# EasyEDA Pro project 2026-01-18_TinZr_Rev5_EasyEDA_project.eprj

# Schematic TinZr_Rev5_Schematic
Board Name: Chip; Create Date: 2025-05-02; Page Name: P1; Project Name: ESP32-C3_Rev5; Schematic Name: TinZr_Rev5_Schematic; Update Date: 2026-01-17; Company: NJIT/WCM; Drawn: Ludvik Alkhoury; Page Size: A4; Reviewed: Tony Moore; Version: Rev5
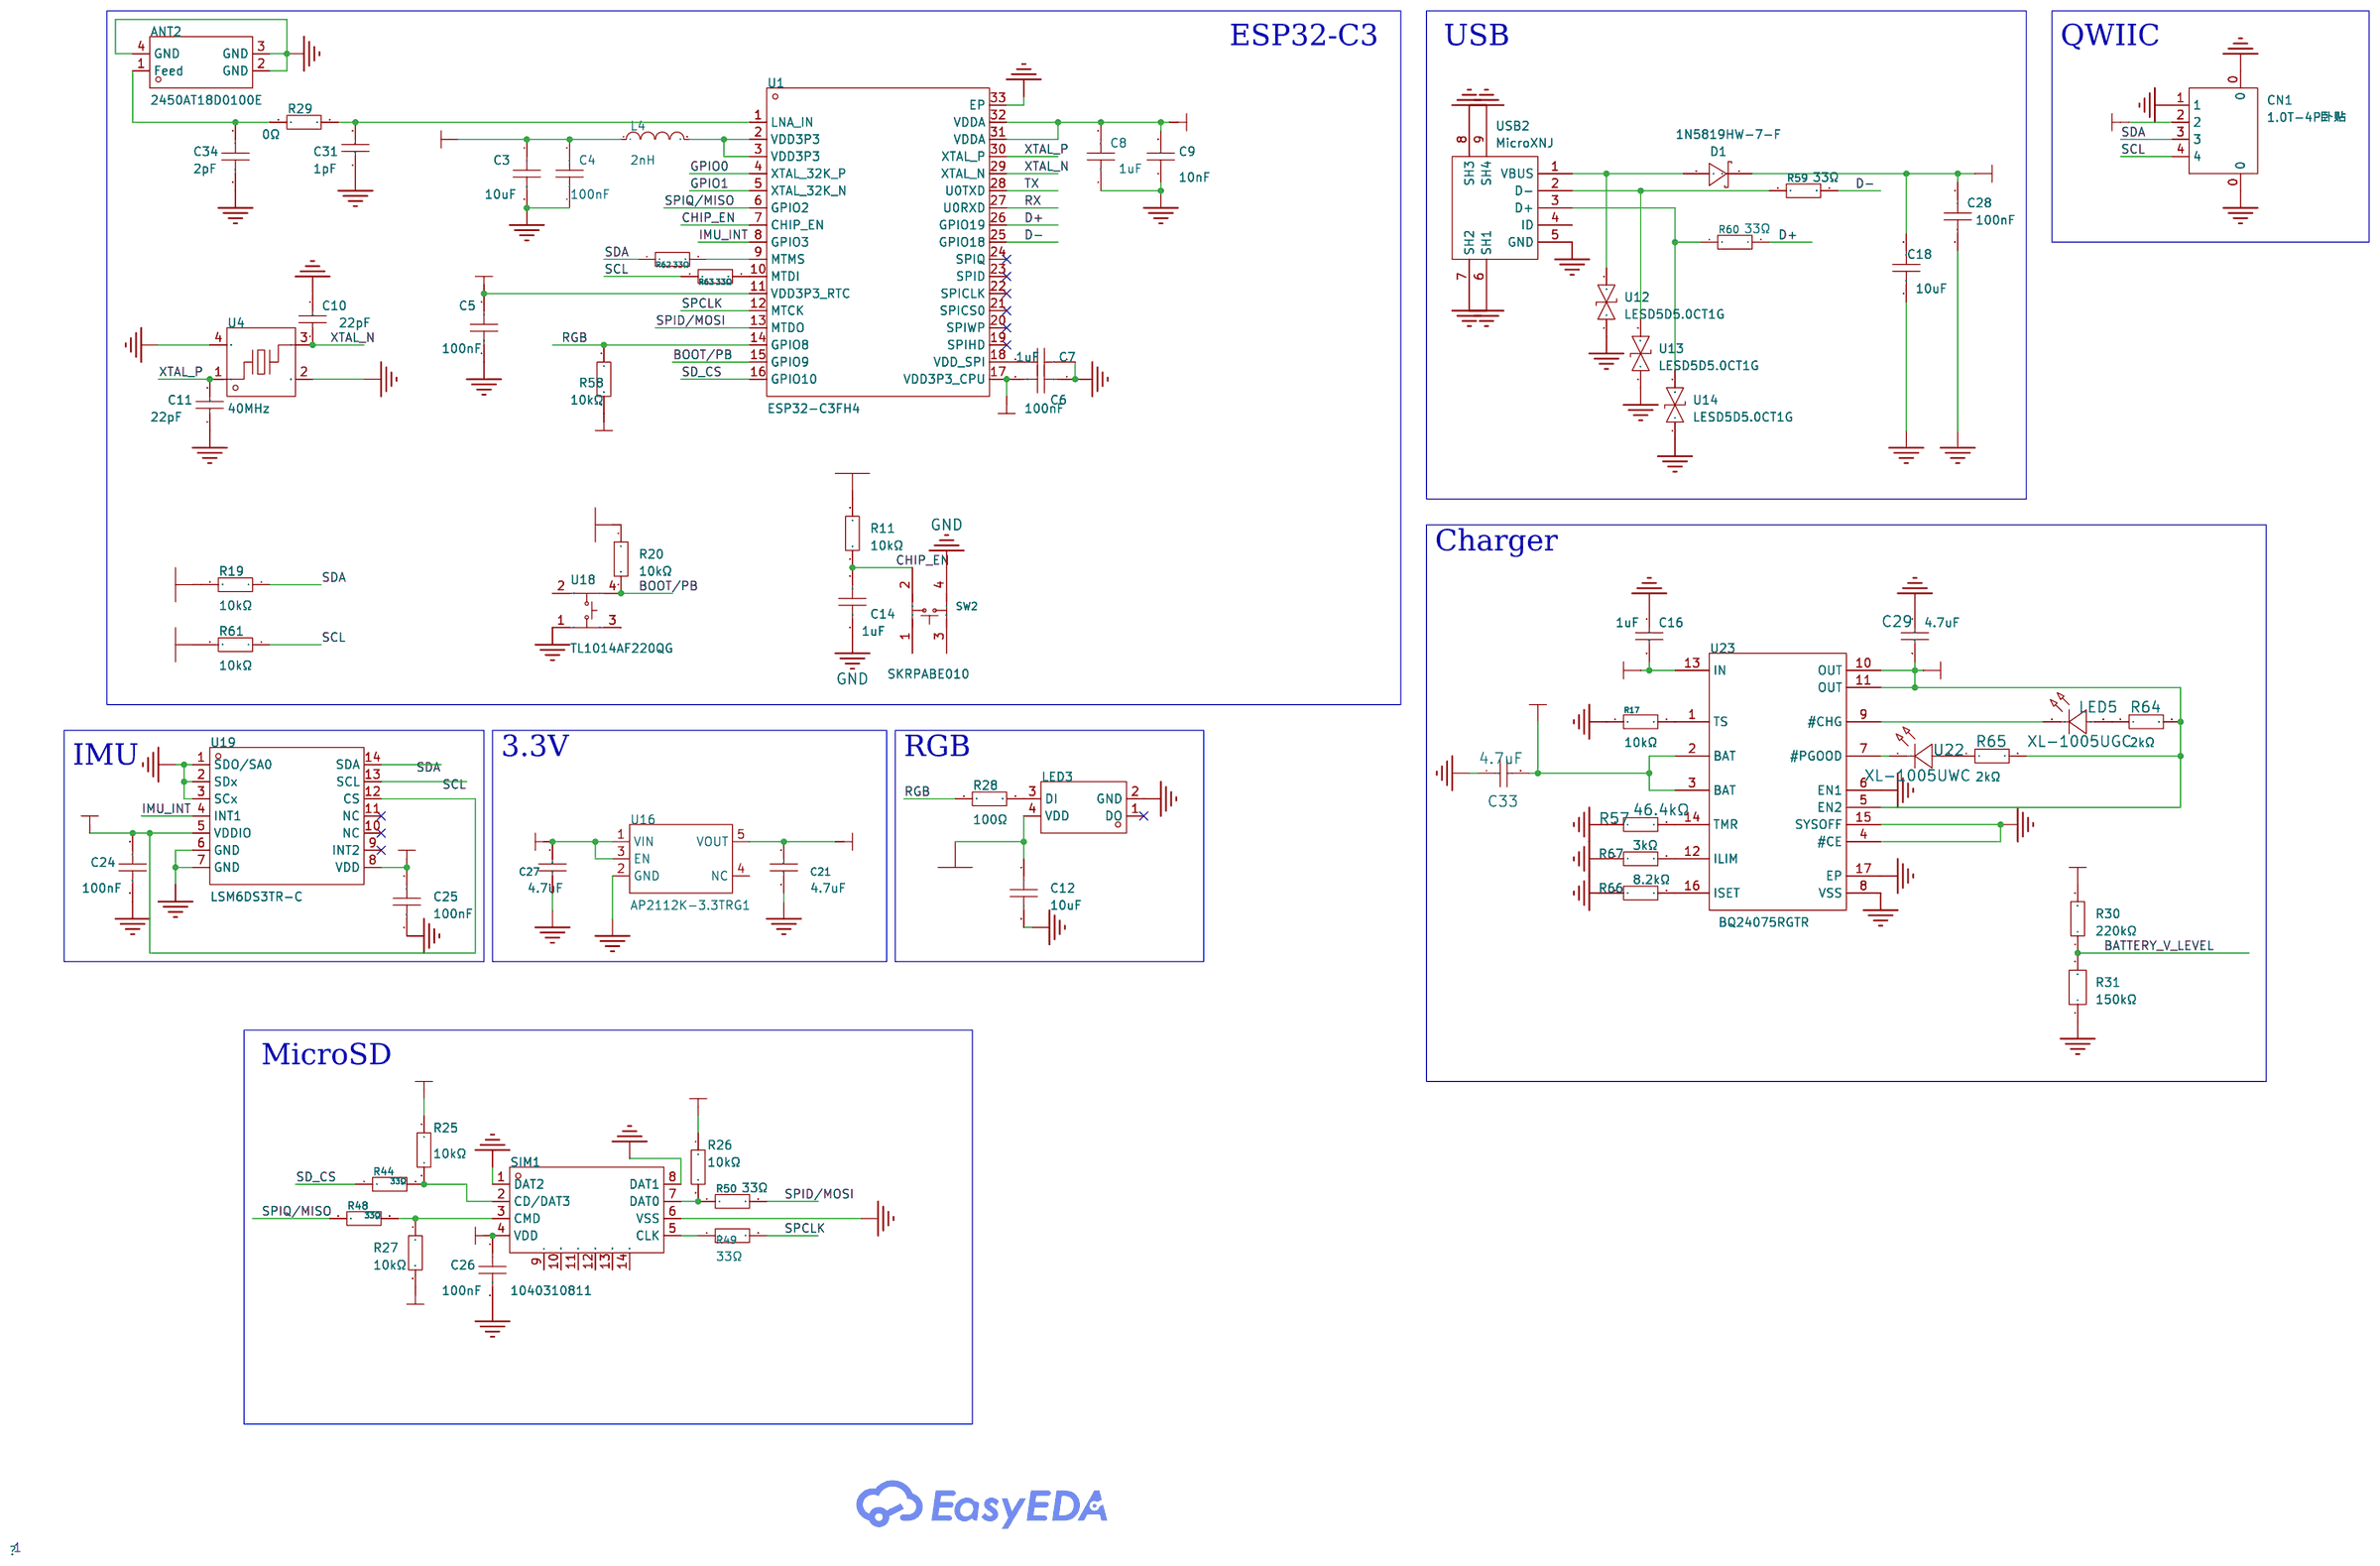
[diagram p0: schematic sheet]

## Parts
ANT2  2450AT18D0100E  [ANT-SMD_4P-L3.2-W1.6]
C3  10uF  [c0402]
C4  100nF  [c0402]
C5  100nF  [c0402]
C6  100nF  [c0402]
C7  1uF  [c0402]
C8  1uF  [c0402]
C9  10nF  [c0402]
C10  22pF  [c0402]
C11  22pF  [c0402]
C12  10uF  [c0402]
C14  1uF  [c0402]
C16  1uF  [C0402]
C18  10uF  [C0805]
C21  4.7uF  [C0603]
C24  100nF  [c0402]
C25  100nF  [c0402]
C26  100nF  [c0402]
C27  4.7uF  [C0603]
C28  100nF  [c0402]
C29  4.7uF  [C0603]
C31  1pF  [C0402]  (no BOM)
C33  4.7uF  [C0603]
C34  2pF  [C0402]
CN1  1.0T-4P卧贴  [CONN-SMD_1.0T-4P]
D1  1N5819HW-7-F  [SOD-123_L2.7-W1.6-LS3.7-RD]
L4  2nH  [L0603]
LED3  WS2812C-2020-V1  [LED-SMD_4P-L2.0-W2.0-TL_WS2812B-2020]
LED5  XL-1005UGC  [LED0402-RD_GREEN]
R11  10kΩ  [r0402]
R17  10kΩ  [R0603]
R19  10kΩ  [r0402]
R20  10kΩ  [r0402]
R25  10kΩ  [r0402]
R26  10kΩ  [r0402]
R27  10kΩ  [r0402]
R28  100Ω  [R0402]
R29  0Ω  [R0402]
R30  220kΩ  [R0402]
R31  150kΩ  [R0402]
R44  33Ω  [R0402]
R48  33Ω  [R0402]
R49  33Ω  [R0402]
R50  33Ω  [R0402]
R57  46.4kΩ  [R0402]
R58  10kΩ  [r0402]
R59  33Ω  [R0402]
R60  33Ω  [R0402]
R61  10kΩ  [r0402]
R62  33Ω  [R0402]
R63  33Ω  [R0402]
R64  2kΩ  [R0402]
R65  2kΩ  [R0402]
R66  8.2kΩ  [R0402]
R67  3kΩ  [R0402]
SIM1  1040310811  [SIM-SMD_8P-1040310811]
SW2  SKRPABE010  [KEY-SMD_4P-L4.2-W3.2-P2.20-LS4.6]
U1  ESP32-C3FH4  [QFN-32_L5.0-W5.0-P0.50-TL-EP3.7]
U4  40MHz  [CRYSTAL-SMD_4P-L2.0-W1.6-BL_7D026000M01]
U12  LESD5D5.0CT1G  [SOD-523_L1.2-W0.8-LS1.6-BI]
U13  LESD5D5.0CT1G  [SOD-523_L1.2-W0.8-LS1.6-BI]
U14  LESD5D5.0CT1G  [SOD-523_L1.2-W0.8-LS1.6-BI]
U16  AP2112K-3.3TRG1  [SOT-23-5_L2.9-W1.6-P0.95-LS2.8-BR]
U18  TL1014AF220QG  [SW-SMD_E-SWITCH_TL1014AFXXX]
U19  LSM6DS3TR-C  [LGA-14_L3.0-W2.5-P0.50-TL]
U22  XL-1005UWC  [LED0402-RD_YELLOW]
U23  BQ24075RGTR  [QFN-16_L3.0-W3.0-P0.50-TL-EP1.7]
USB2  MicroXNJ  [MICRO-USB-SMD_MICROXNJ_1]

## Library data of the parts
ANT2 = 2450AT18D0100E: LCSC Part Name: 2.4-2.5GHz; Supplier Part: C2917718; Manufacturer: JOHANSON(约翰逊); Supplier Footprint: 1206; JLCPCB Part Class: Extended Part; Datasheet: https://atta.szlcsc.com/upload/public/pdf/source/20240402/27B7F25B31BFFE47FFBDA84F15358426.pdf; Supplier: LCSC; Antenna Type: Chip Antenna; Central Frequency: 2.4GHz; Peak Gain: 1.5dBi; Power capacity: 2W
C3 C12 = CL10A106KP8NNNC: 容值:10uF;精度:±10%;额定电压:10V;材质(温度系数):X5R;; LCSC Part Name: 10uF ±10% 10V; Supplier Part: C315248; Manufacturer: SAMSUNG(三星); Manufacturer Part: CL05A106MP5NUNC; Supplier Footprint: 0603; JLCPCB Part Class: 基础库; Datasheet: https://atta.szlcsc.com/upload/public/pdf/source/20160218/1457707763339.pdf; Supplier: LCSC; Tolerance: ±10%; Voltage Rated: 10V; Temperature Coefficient: X5R
C4-C6 C24-C26 C28 = CL05B104KO5NNNC: 容值:100nF;精度:±10%;额定电压:16V;材质(温度系数):X7R;; LCSC Part Name: 100nF ±10% 16V; Supplier Part: C1525; Manufacturer: SAMSUNG(三星); Supplier Footprint: 0402; JLCPCB Part Class: 基础库; Datasheet: https://atta.szlcsc.com/upload/public/pdf/source/20160218/1457707763339.pdf; Supplier: LCSC; Tolerance: ±10%; Voltage Rated: 16V; Temperature Coefficient: X7R
C7 C8 C14 = CL05A105KA5NQNC: 容值:1uF;精度:±10%;额定电压:25V;材质(温度系数):X5R;; LCSC Part Name: 1uF ±10% 25V; Supplier Part: C52923; Manufacturer: SAMSUNG(三星); Supplier Footprint: 0402; JLCPCB Part Class: 基础库; Datasheet: https://atta.szlcsc.com/upload/public/pdf/source/20160218/1457707763339.pdf; Supplier: LCSC; Tolerance: ±10%; Voltage Rated: 25V; Temperature Coefficient: X5R
C9 = CL05B103KB5NNNC: 容值:10nF;精度:±10%;额定电压:50V;材质(温度系数):X7R;; LCSC Part Name: 10nF ±10% 50V; Supplier Part: C15195; Manufacturer: SAMSUNG(三星); Supplier Footprint: 0402; JLCPCB Part Class: 基础库; Datasheet: https://atta.szlcsc.com/upload/public/pdf/source/20160218/1457707763339.pdf; Supplier: LCSC; Tolerance: ±10%; Voltage Rated: 50V; Temperature Coefficient: X7R
C10 C11 = 0402CG220J500NT: 容值:22pF;精度:±5%;额定电压:50V;材质(温度系数):C0G;; LCSC Part Name: 22pF ±5% 50V; Supplier Part: C1555; Manufacturer: FH(风华); Supplier Footprint: 0402; JLCPCB Part Class: 基础库; Datasheet: https://atta.szlcsc.com/upload/public/pdf/source/20200305/C486355_26A10D38EF8C2A5C37091D0039909270.pdf; Supplier: LCSC; Tolerance: ±5%; Voltage Rated: 50V; Temperature Coefficient: C0G
C16 = LMK105BJ105KV-F: LCSC Part Name: 1uF ±10% 10V; Supplier Part: C87145; Manufacturer: TAIYO YUDEN(太诱); Supplier Footprint: 0402; JLCPCB Part Class: Extended Part; Datasheet: https://atta.szlcsc.com/upload/public/pdf/source/20190909/C426322_488BD416A500F475FF85774A153C014C.pdf; Supplier: LCSC; Tolerance: ±10%
C18 = CL21A106KAYNNNE_C15850: LCSC Part Name: 10uF ±10% 25V; Supplier Part: C15850; Manufacturer: SAMSUNG(三星); Manufacturer Part: CL21A106KAYNNNE; Supplier Footprint: 0805; JLCPCB Part Class: Basic Part; Datasheet: https://atta.szlcsc.com/upload/public/pdf/source/20160218/1457707763339.pdf; Supplier: LCSC; Tolerance: ±10%
C21 C27 C29 C33 = CL10A475KP8NNNC: LCSC Part Name: 4.7uF ±10% 10V; Supplier Part: C1705; Manufacturer: SAMSUNG(三星); Manufacturer Part: CL10A475KO8NNNC; Supplier Footprint: 0603; JLCPCB Part Class: Extended Part; Datasheet: https://atta.szlcsc.com/upload/public/pdf/source/20160218/1457707763339.pdf; Supplier: LCSC; Tolerance: ±10%
C31 = GRM1555C1H1R0CA01D: LCSC Part Name: 1pF 50V; Supplier Part: C76953; Manufacturer: muRata(村田); Supplier Footprint: 0402; JLCPCB Part Class: Extended Part; Datasheet: https://atta.szlcsc.com/upload/public/pdf/source/20180307/C76953_15204091218821407741.pdf; Supplier: LCSC
C34 = CGA2B2NP01H020C050BA: LCSC Part Name: ±0.25pF 2pF 50V; Supplier Part: C2181699; Manufacturer: TDK; Supplier Footprint: 0402; JLCPCB Part Class: Extended Part; Datasheet: https://item.szlcsc.com/datasheet/CGA2B2NP01H020C050BA/2273766.html; Supplier: LCSC; Voltage Rating: 50V; Temperature Coefficient: NP0
CN1 = 1.0T-4P卧贴: LCSC Part Name: 1x4P 间距:1mm 卧贴 系列:SH; Supplier Part: C145956; Manufacturer: BOOMELE(博穆精密); Supplier Footprint: SMD,P=1mm; JLCPCB Part Class: Extended Part; Datasheet: https://atta.szlcsc.com/upload/public/pdf/source/20171115/C145958_15107293423141120443.pdf; Supplier: LCSC; Pins Structure: 1x4P; Pitch: 1mm; Mounting Type: Horizontal attachment; Reference Series: SH; Number of Pins: 4P; Number of Rows: 1; Number of PINs Per Row: 4
D1 = 1N5819HW-7-F: LCSC Part Name: 电压:40V 电流:1A; Supplier Part: C82544; Manufacturer: DIODES(美台); Supplier Footprint: SOD-123; JLCPCB Part Class: Extended Part; Datasheet: https://atta.szlcsc.com/upload/public/pdf/source/20161024/1477288459223.pdf; Supplier: LCSC; Forward Voltage (Vf@If): 450mV@1A; Reverse Voltage (Vr): 40V; Rectified Current: 1A; Reverse Leakage Current (Ir): 1mA@40V
L4 = SDCL1608C2N0STDF_C370234: Supplier Part: C370234; Manufacturer: Sunlord(顺络); Manufacturer Part: SDCL1608C2N0STDF; Supplier Footprint: 0603; JLCPCB Part Class: Extended Part; Datasheet: https://item.szlcsc.com/datasheet/SDCL1608C2N0STDF/343985.html; Supplier: LCSC
LED3 = WS2812C-2020-V1: 小电流，小尺寸，适用于小尺寸，小间距产品，散热好，汽车氛围灯; LCSC Part Name: RGB三色; Supplier Part: C2976072; Manufacturer: worldsemi; Supplier Footprint: SMD,2x2mm; JLCPCB Part Class: 扩展库; Datasheet: https://atta.szlcsc.com/upload/public/pdf/source/20220222/52A01000447F5320C9A8C3F34CEFDB81.pdf; Supplier: LCSC
LED5 = XL-1005UGC_C965793: Supplier Part: C965793; Manufacturer: XINGLIGHT(成兴光); Supplier Footprint: 0402; JLCPCB Part Class: Extended Part; Datasheet: https://atta.szlcsc.com/upload/public/pdf/source/20201230/C965793_0CDDD21E721E0FD2A4CEAFDFDBC3C135.pdf; Supplier: LCSC; Emitted Color: Emerald; Forward Voltage (VF): 3V; Power Dissipation: 80mW; Forward Current: 25mA; Dominant Wavelength: 516nm~531nm; Peak Wavelength: 531nm; Lens Color: Colorless Transparent Lens; Luminous Intensity: 249mcd; Viewing Angle: 120°; Mounting Sytle: Positive Stick; Operating Temperature: -30℃~+85℃
R11 R19 R20 R25-R27 R58 R61 = 0603WAF1002T5E: 电阻类型:厚膜电阻;阻值:10kΩ;精度:±1%;功率:1/10W;温度系数:±100ppm/;最大工作电压:75V;工作温度范围:-55~+155;; LCSC Part Name: 10kΩ±1%1/10W; Supplier Part: C25804; Manufacturer: UNI-ROYAL(厚声); Supplier Footprint: 0603; JLCPCB Part Class: BasicPart; Datasheet: https://atta.szlcsc.com/upload/public/pdf/source/20200306/C422600_1E6D84923E4A46A82E41ADD87F860B5C.pdf; Supplier: LCSC; Type: 厚膜电阻; Tolerance: ±1%; Power(Watts): 1/10W; Temperature Coefficient: ±100ppm/; Overload Voltage (Max): 75V; Operating Temperature Range: -55~+155
R17 = 0603WAF1002T5E: LCSC Part Name: 厚膜电阻 10kΩ ±1% 100mW; Supplier Part: C25804; Manufacturer: UNI-ROYAL(厚声); Supplier Footprint: 0603; JLCPCB Part Class: Basic Part; Datasheet: https://atta.szlcsc.com/upload/public/pdf/source/20200306/C422600_1E6D84923E4A46A82E41ADD87F860B5C.pdf; Supplier: LCSC; Type: Thick Film Resistors; Tolerance: ±1%; Temperature Coefficient: ±100ppm/℃; Operating Temperature Range: -55℃~+155℃
R28 = RC0402FR-07100RL: LCSC Part Name: 厚膜电阻 100Ω ±1% 62.5mW; Supplier Part: C106232; Manufacturer: YAGEO(国巨); Supplier Footprint: 0402; JLCPCB Part Class: Extended Part; Datasheet: https://atta.szlcsc.com/upload/public/pdf/source/20180927/C295883_E8D83085EA81BD7DE0B2B681138C15EE.pdf; Supplier: LCSC; Type: Thick Film Resistors; Tolerance: ±1%; Temperature Coefficient: ±100ppm/℃; Operating Temperature Range: -55℃~+155℃
R29 = RC0402JR-070RL: LCSC Part Name: 厚膜电阻 0Ω ±5% 62.5mW; Supplier Part: C60485; Manufacturer: YAGEO(国巨); Supplier Footprint: 0402; JLCPCB Part Class: Extended Part; Datasheet: https://atta.szlcsc.com/upload/public/pdf/source/20170428/1493376821999.pdf; Supplier: LCSC; Type: Thick Film Resistors; Tolerance: ±5%; Operating Temperature: -55℃~+155℃
R30 = RC0402JR-07220KL: LCSC Part Name: 厚膜电阻 220kΩ ±5% 62.5mW; Supplier Part: C137900; Manufacturer: YAGEO(国巨); Supplier Footprint: 0402; JLCPCB Part Class: Extended Part; Datasheet: https://atta.szlcsc.com/upload/public/pdf/source/20181009/C309620_DA5935B6E1D48212CB7A533FE518B3C2.pdf; Supplier: LCSC; Type: Thick Film Resistors; Tolerance: ±5%; Temperature Coefficient: ±100ppm/℃; Operating Temperature Range: -55℃~+155℃
R31 = FRC0402F1503TS: LCSC Part Name: 150kΩ ±1% 62.5mW 厚膜电阻; Supplier Part: C2909320; Manufacturer: FOJAN(富捷); Supplier Footprint: 0402; JLCPCB Part Class: Extended Part; Datasheet: https://atta.szlcsc.com/upload/public/pdf/source/20211221/925EC7D7225764EE0046F22065062C87.pdf; Supplier: LCSC; Type: Thick Film Resistor; Tolerance: ±1%; Power(Watts): 62.5mW; Voltage-Supply(Max): 50V; Temperature Coefficient: ±100ppm/℃; Operating Temperature: -55℃~+155℃
R44 R48-R50 R59 R60 R62 R63 = 0402WGF330JTCE: LCSC Part Name: 33Ω ±1% 62.5mW 厚膜电阻; Supplier Part: C25105; Manufacturer: UNI-ROYAL(厚声); Supplier Footprint: 0402; JLCPCB Part Class: Basic Part; Datasheet: https://atta.szlcsc.com/upload/public/pdf/source/20200306/C422600_1E6D84923E4A46A82E41ADD87F860B5C.pdf; Supplier: LCSC; Type: Thick Film Resistors; Tolerance: ±1%; Temperature Coefficient: ±100ppm/℃; Operating Temperature Range: -55℃~+155℃
R57 = RC0402FR-0746K4L: Type:Thick Film Resistor Resistance:46.4kΩ Tolerance:±1% Tolerance:±1% Power(Watts):62.5mW Voltage-Supply(Max):50V Temperature Coefficient:±100ppm/℃ Temperature Coefficient:±100ppm/℃ Operating Temperature:-55℃~+155℃ Operating Temperature:-55℃~+155℃; LCSC Part Name: 厚膜电阻 46.4kΩ ±1% 62.5mW; Supplier Part: C185412; Manufacturer: YAGEO(国巨); Supplier Footprint: 0402; JLCPCB Part Class: Extended Part; Datasheet: https://atta.szlcsc.com/upload/public/pdf/source/20250610/89E4D743C004A82A45145C7A2CC3A578.pdf; Supplier: LCSC; Type: Thick Film Resistor; Tolerance: ±1%; Power(Watts): 62.5mW; Voltage-Supply(Max): 50V; Temperature Coefficient: ±100ppm/℃; Operating Temperature: -55℃~+155℃
R64 R65 = 0402WGF2001TCE: LCSC Part Name: 2kΩ ±1% 62.5mW 厚膜电阻; Supplier Part: C4109; Manufacturer: UNI-ROYAL(厚声); Supplier Footprint: 0402; JLCPCB Part Class: Basic Part; Datasheet: https://atta.szlcsc.com/upload/public/pdf/source/20200306/C422600_1E6D84923E4A46A82E41ADD87F860B5C.pdf; Supplier: LCSC; Type: Thick Film Resistors; Tolerance: ±1%; Temperature Coefficient: ±100ppm/℃; Operating Temperature Range: -55℃~+155℃
R66 = RC0402FR-078K2L: LCSC Part Name: 厚膜电阻 8.2kΩ ±1% 62.5mW; Supplier Part: C137929; Manufacturer: YAGEO(国巨); Supplier Footprint: 0402; JLCPCB Part Class: Extended Part; Datasheet: https://item.szlcsc.com/datasheet/RC0402FR-078K2L/149245.html; Supplier: LCSC; Type: Thick Film Resistor; Tolerance: ±1%; Power(Watts): 62.5mW; Voltage-Supply(Max): 50V; Temperature Coefficient: ±100ppm/℃; Operating Temperature: -55℃~+155℃
R67 = RC0402FR-073KL: LCSC Part Name: 厚膜电阻 3kΩ ±1% 62.5mW; Supplier Part: C137987; Manufacturer: YAGEO(国巨); Supplier Footprint: 0402; JLCPCB Part Class: Extended Part; Datasheet: https://item.szlcsc.com/datasheet/RC0402FR-073KL/149303.html; Supplier: LCSC; Type: Thick Film Resistor; Tolerance: ±1%; Power(Watts): 62.5mW; Voltage-Supply(Max): 50V; Temperature Coefficient: ±100ppm/℃; Operating Temperature: -55℃~+155℃
SIM1 = 1040310811: LCSC Part Name: 拔插式 MicroSD卡(TF卡) 卡座; Supplier Part: C585350; Manufacturer: MOLEX; Supplier Footprint: SMD; JLCPCB Part Class: Extended Part; Datasheet: https://www.molex.com/content/dam/molex/molex-dot-com/products/automated/en-us/salesdrawingpdf/104/104031/1040310811_sd.pdf?inline; Supplier: LCSC; Card Connection Mode: Plug-in; Card Type: MicroSD card (TF card); Connector Type: Card Slot; Height Above Board: 1.42mm; Operating Temperature: -25℃~+85℃
SW2 = SKRPABE010: LCSC Part Name: 4.2*3.2*2.5mm 立贴 轻触开关; Supplier Part: C115360; Manufacturer: ALPSALPINE(阿尔卑斯阿尔派); Supplier Footprint: SMD; JLCPCB Part Class: Extended Part; Datasheet: https://atta.szlcsc.com/upload/public/pdf/source/20230112/DF75D5D18E1B5268218CBB1743AEACBB.pdf; Supplier: LCSC; Circuit: SPST; Actuator Style: Oval button; Mounting Style: Brick nogging; Switch Length: 4.2mm; Switch Width: 3.2mm; Switch Height: 2.5mm; Contact Current: 50mA; Voltage Rating (DC): 16V
U1 = ESP32-C3FH4: Supplier Part: C2858491; Manufacturer: ESPRESSIF(乐鑫); Supplier Footprint: QFN-32-EP(5x5); JLCPCB Part Class: 扩展库; Datasheet: https://atta.szlcsc.com/upload/public/pdf/source/20241030/9E2CC81EADAF965BF8A3CB78FAC4244F.pdf; Supplier: LCSC
U4 = X252040MMB4SI: 晶振类型:贴片晶振;频率:40MHz;常温频差:±10ppm;外接负载电容:10pF;频率稳定度(全温):±20ppm;; LCSC Part Name: 40MHz ±10ppm 10pF; Supplier Part: C2885592; Manufacturer: YXC(扬兴晶振); Supplier Footprint: SMD2520-4P; JLCPCB Part Class: 扩展库; Datasheet: https://atta.szlcsc.com/upload/public/pdf/source/20240329/8B53C0AFBC5BB264DFB5D72B3757797A.pdf; Supplier: LCSC; Crystal Type: 贴片晶振; Normal temperature Frequency Tolerance: ±10ppm; External load capacitor: 10pF; Frequency Stability(Full temperature range): ±20ppm; Operating Temperature: -40℃~+85℃
U12-U14 = LESD5D5.0CT1G_C5246195: Supplier Part: C5246195; Manufacturer: Leiditech(雷卯电子); Supplier Footprint: SOD-523; JLCPCB Part Class: Extended Part; Datasheet: https://atta.szlcsc.com/upload/public/pdf/source/20221108/1C42B36F7D16189BC2911DA9C8277455.pdf; Supplier: LCSC
U16 = AP2112K-3.3TRG1_C23380830: LCSC Part Name: 集成电路; Supplier Part: C23380830; Manufacturer: TECH PUBLIC(台舟); Supplier Footprint: SOT-23-5; JLCPCB Part Class: Extended Part; Datasheet: https://atta.szlcsc.com/upload/public/pdf/source/20240628/1D097D6CC1633358334BACAAC860428E.pdf; Supplier: LCSC
U18 = TL1014AF220QG: Supplier Part: C4364321; Manufacturer: E-Switch; JLCPCB Part Class: Extended Part; Supplier: LCSC; Circuit: SPST; Actuator Style: Rectangle button; Operating Force: 220gf; Mounting Style: Brick nogging; Contact Current: 0.05A; Voltage Rating (DC): 12V; Pin Style: Gull Wing; Mechanical Life: 100000次; Operating Temperature: -40℃~+85℃
U19 = LSM6DS3TR-C: LCSC Part Name: IMU-惯性测量单元; Supplier Part: C967633; Manufacturer: ST(意法半导体); Supplier Footprint: LGA-14(2.5x3); JLCPCB Part Class: Extended Part; Datasheet: https://atta.szlcsc.com/upload/public/pdf/source/20210226/C967633_4D8B3A108D63359423D57B97CE5134B1.pdf; Supplier: LCSC; Sensor Type: Accelerometer gyroscope; Operating Temperature: -40℃~+85℃
U22 = XL-1005UWC_C20613596: Supplier Part: C20613596; Manufacturer: XINGLIGHT(成兴光); Supplier Footprint: 0402; JLCPCB Part Class: Extended Part; Datasheet: https://atta.szlcsc.com/upload/public/pdf/source/20221102/EACC1BAE175C81995A6088DD8BE6A010.pdf; Supplier: LCSC
U23 = BQ24075RGTR: The Chip Type:Charging IC Voltage - Supply:4.35V~6.4V Voltage - Supply:4.35V~6.4V Charge Current - Max:1.5A Charging Saturation Voltage:4.2V Type of Battery:Lithium Battery Number of Cells:- Number of Cells:- Operating Temperature:-40℃~+125℃ Operating Tem; LCSC Part Name: 锂离子电池充电器和电源路径管理IC; Supplier Part: C15464; Manufacturer: TI(德州仪器); Supplier Footprint: QFN-16-EP(3x3); JLCPCB Part Class: Extended Part; Datasheet: http://www.ti.com/cn/lit/gpn/bq24075; Supplier: LCSC; The Chip Type: Charging IC; Voltage - Supply: 4.35V~6.4V; Charge Current - Max: 1.5A; Charging Saturation Voltage: 4.2V; Type of Battery: Lithium Battery; Operating Temperature: -40℃~+125℃; Battery Temperature Detection: Support; 0V Battery Charge: Not Supported
USB2 = MicroXNJ: Connector Type:Micro-B Protocol Standard:USB 2.0 Gender:Female Mounting Type:Surface Mount, Right Angle Number of Contacts:5P Number of Ports:1 Current Rating-Power:1.8A Voltage Rating:30V Connect-Disconnect Life:5,000 times Detection color:Black Operatin; LCSC Part Name: Micro-B 母 卧贴; Supplier Part: C404969; Manufacturer: SHOU HAN(首韩); Supplier Footprint: SMD; JLCPCB Part Class: Extended Part; Datasheet: https://item.szlcsc.com/datasheet/MicroXNJ/392534.html; Supplier: LCSC; Connector Type: Micro-B; Gender: Female; Number of Contacts: 5P; Number of Ports: 1; Connect-Disconnect Life: 5,000 times; Protocol Standard: USB 2.0; Mounting Type: Surface Mount, Right Angle; Current Rating-Power: 1.8A; Voltage Rating: 30V; Detection color: Black; Operating Temperature: -20℃~+85℃

## Nets
+3V3: C3.1 C4.2 C5.2 C6.2 C8.2 C9.2 C12.1 C21.2 C24.1 C25.1 C26.1 CN1.2 L4.1 LED3.4(VDD) R11.2 R19.2 R20.1 R25.1 R26.1 R27.2 R58.2 R61.2 SIM1.4(VDD) U1.11(VDD3P3_RTC) U1.17(VDD3P3_CPU) U1.31(VDDA) U1.32(VDDA) U16.5(VOUT) U19.5(VDDIO) U19.8(VDD) U19.12(CS)
GND: ANT2.2(GND) ANT2.3(GND) ANT2.4(GND) C3.2 C4.1 C5.1 C6.1 C7.1 C8.1 C9.1 C10.2 C11.1 C12.2 C14.1 C16.1 C18.1 C21.1 C24.2 C25.2 C26.2 C27.1 C28.2 C29.1 C31.1 C33.1 C34.1 CN1.0 CN1.1 LED3.2(GND) R17.1 R31.1 R57.1 R66.1 R67.1 SIM1.1(DAT2) SIM1.6(VSS) SIM1.8(DAT1) SW2.4 U1.33(EP) U4.2(GND) U4.4(GND) U12.1 U13.1 U14.1 U16.2(GND) U18.1 U19.1(SDO/SA0) U19.2(SDx) U19.3(SCx) U19.6(GND) U19.7(GND) U23.4(#CE) U23.6(EN1) U23.8(VSS) U23.15(SYSOFF) U23.17(EP) USB2.5(GND) USB2.6(SH1) USB2.7(SH2) USB2.8(SH3) USB2.9(SH4)
VBUS: C16.2 C18.2 C28.1 D1.1(K) U23.13(IN)
BAT+: C33.2 R30.2 U23.2(BAT) U23.3(BAT)
BATTERY_V_LEVEL: R30.1 R31.2
BOOT/PB: R20.2 U1.15(GPIO9) U18.4
CHIP_EN: C14.2 R11.1 SW2.2 U1.7(CHIP_EN)
D+: R60.2 U1.26(GPIO19)
D-: R59.2 U1.25(GPIO18)
GPIO0: U1.4(XTAL_32K_P)
GPIO1: U1.5(XTAL_32K_N)
IMU_INT: U1.8(GPIO3) U19.4(INT1)
POW: C27.2 C29.2 R64.2 R65.2 U16.1(VIN) U16.3(EN) U23.5(EN2) U23.10(OUT) U23.11(OUT)
RGB: R28.1 R58.1 U1.14(GPIO8)
RX: U1.27(U0RXD)
SCL: CN1.4 R61.1 R63.1 U19.13(SCL)
SD_CS: R44.1 U1.16(GPIO10)
SDA: CN1.3 R19.1 R62.1 U19.14(SDA)
SPCLK: R49.2 U1.12(MTCK)
SPID/MOSI: R50.2 U1.13(MTDO)
SPIQ/MISO: R48.1 U1.6(GPIO2)
TX: U1.28(U0TXD)
XTAL_N: C10.1 U1.29(XTAL_N) U4.3
XTAL_P: C11.2 U1.30(XTAL_P) U4.1
$1N1048: L4.2 U1.2(VDD3P3) U1.3(VDD3P3)
$1N1429: C7.2 U1.18(VDD_SPI)
$1N2460: C31.2 R29.2 U1.1(LNA_IN)
$1N25832: D1.2(A) U12.2 USB2.1(VBUS)
$1N25847: R59.1 U13.2 USB2.2(D-)
$1N25849: R60.1 U14.2 USB2.3(D+)
$1N31251: ANT2.1(Feed) C34.2 R29.1
$1N47755: LED3.3(DI) R28.2
$1N85064: R26.2 R50.1 SIM1.7(DAT0)
$1N94189: U22.1(K) U23.7(#PGOOD)
$1N94195: LED5.1(K) U23.9(#CHG)
$1N94200: R17.2 U23.1(TS)
$1N94207: R57.2 U23.14(TMR)
$1N94553: R27.1 R48.2 SIM1.3(CMD)
$1N94607: R49.1 SIM1.5(CLK)
$1N94651: R25.2 R44.2 SIM1.2(CD/DAT3)
$1N97194: R62.2 U1.9(MTMS)
$1N97235: R63.2 U1.10(MTDI)
$1N106267: LED5.2(A) R64.1
$1N106270: R65.1 U22.2(A)
$1N126315: R66.2 U23.16(ISET)
$1N126394: R67.2 U23.12(ILIM)

Not connected (* = marked no-connect by the designer): LED3 1(DO)*; SIM1 9 10 11 12 13 14; SW2 1 3; U1 19(SPIHD)* 20(SPIWP)* 21(SPICS0)* 22(SPICLK)* 23(SPID)* 24(SPIQ)*; U16 4(NC); U18 2 3; U19 9(INT2)* 10(NC)* 11(NC)*; USB2 4(ID)

## Notes on the sheet
- ESP32-C3
- USB
- QWIIC
- Charger
- 3.3V
- RGB
- IMU
- MicroSD

# Board TinZr_Rev5_PCB
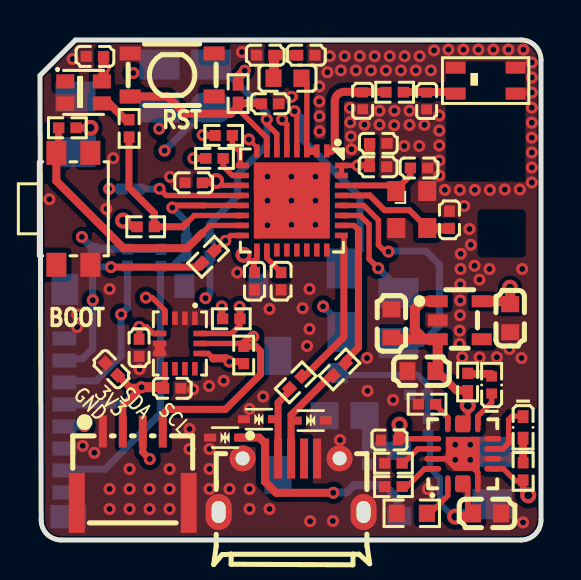
[diagram p1: board, top side]
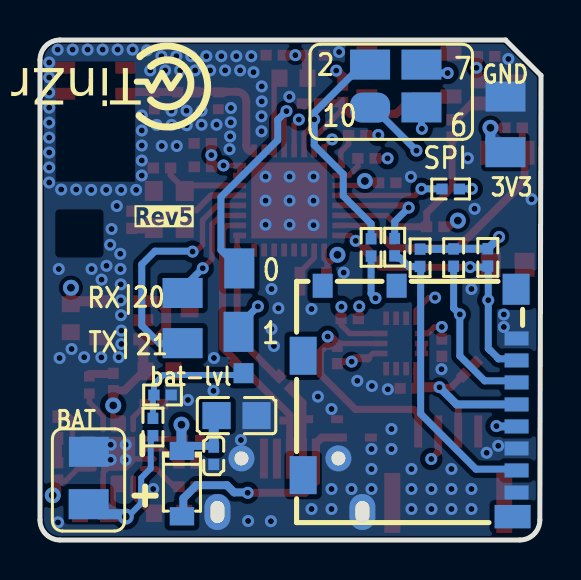
[diagram p2: board, bottom side, seen from below]

Outline 25.06 x 25 mm; copper layers: Top Layer, Inner1, Inner2, Bottom Layer. Coordinates in mm from the lower left corner of the outline.
Outline path: 0,23.23 0.06,1 arc(0.35,0.29) 1.06,0 24.06,0 arc(24.77,0.29) 25.06,1 25.06,24 arc(24.77,24.71) 24.06,25 1.78,25 0,23.23
Stack: Top Layer 0.035mm 外层铜厚1oz / Dielectric1 0.2104mm 7628 RC49% 8.6mil / Inner1 0.0152mm 内层铜厚 / Dielectric2 1.065mm 1.1mm H/HOZ Copper / Inner2 0.0152mm 内层铜厚 / Dielectric3 0.2104mm 7628 RC49% 8.6mil / Bottom Layer 0.035mm 外层铜厚1oz

## Design rules (mm)
template: 自定义配置
spacing copperThickness1oz (default): track to track 0.102, other pairs 0.099 to 0.15
spacing copperThickness2oz: track to track 0.203, other pairs 0.152 to 0.3
track width copperThickness1oz (default): min 0.127, default 0.2, max 2.54
track width copperThickness2oz: min 0.203, default 0.254, max 2.54
track width 0.3mm: min 0.254, default 0.3, max 0.5
differential pair differentialPair (default): width min 0.127, default 0.254, max 2.54; gap min 0.152, default 0.152
via viaSize (default): diameter min 0.4, default 0.4, max 10; hole min 0.3, default 0.3, max 6.3
net +3V3 uses 0.3mm, 直连
net GND uses 直连

## Placement (name value [footprint] x y rotation side)
ANT2  2450AT18D0100E  [ANT-SMD_4P-L3.2-W1.6]  22.29 22.97 0 top
C3  10uF  [c0402]  11.27 24.24 180 top
C4  100nF  [c0402]  13.32 24.24 180 top
C5  100nF  [c0402]  7.69 17.86 0 top
C6  100nF  [c0402]  10.73 12.94 90 top
C7  1uF  [c0402]  12.06 12.94 90 top
C8  1uF  [c0402]  16.92 19.83 180 top
C9  10nF  [c0402]  16.91 18.66 180 top
C10  22pF  [c0402]  20.48 16.01 90 top
C11  22pF  [c0402]  18.96 18.6 180 top
C12  10uF  [c0402]  2.75 24.18 180 top
C14  1uF  [c0402]  11.51 21.81 180 top
C16  1uF  [C0402]  17.48 5 0 top
C18  10uF  [C0805]  15.23 6.22 0 bottom
C21  4.7uF  [C0603]  23.52 11.09 90 top
C24  100nF  [c0402]  4.96 9.62 270 top
C25  100nF  [c0402]  6.62 7.59 0 top
C26  100nF  [c0402]  3.58 8.54 135 top
C27  4.7uF  [C0603]  17.58 10.83 270 top
C28  100nF  [c0402]  16.37 4.21 270 bottom
C29  4.7uF  [C0603]  19.08 8.44 0 top
C31  1pF  [C0402]  16.14 21.96 90 top
C33  4.7uF  [C0603]  22.36 1.33 180 top
C34  2pF  [C0402]  19.34 21.95 90 top
CN1  1.0T-4P卧贴  [CONN-SMD_1.0T-4P]  4.64 3.64 0 top
D1  1N5819HW-7-F  [SOD-123_L2.7-W1.6-LS3.7-RD]  17.96 2.82 270 bottom
L4  2nH  [L0603]  12.38 23.09 0 top
LED3  WS2812C-2020-V1  [LED-SMD_4P-L2.0-W2.0-TL_WS2812B-2020]  2.18 22.38 0 top
LED5  XL-1005UGC  [LED0402-RD_GREEN]  22.59 7.75 90 top
NOREF  -  [Pad_e8927]  8.55 21.62 180 top
NOREF#2  -  [Pad_e1200]  17.93 9.84 0 top
NOREF#3  -  [Pad_e1288]  21.15 5.81 0 top
NOREF#4  -  [Pad_e4021]  15.13 10.41 90 top
NOREF#5  -  [Pad_e8926]  5.98 21.63 180 top
NOREF#6  -  [Pad_e7330]  17.93 12.35 180 top
NOREF#7  -  [Pad_e751]  14.88 8.34 180 top
NOREF#8  -  [Pad_e4]  21.15 2.81 0 top
NOREF#9  -  [Pad_e8322]  1.78 19.39 0 top
NOREF#10  -  [Pad_e8320]  1.77 22.17 0 top
NOREF#11  -  [Pad_e8323]  5.98 23.77 180 top
NOREF#12  -  [Pad_e7559]  22.61 4.41 0 top
NOREF#13  -  [Pad_e7560]  22.62 1.79 0 top
NOREF#14  -  [Pad_e8324]  8.55 23.77 180 top
NOREF#15  -  [Pad_e4022]  15.09 13.58 90 top
R11  10kΩ  [r0402]  9.91 22.32 90 top
R17  10kΩ  [R0603]  18.6 1.34 0 top
R19  10kΩ  [r0402]  9.57 11.06 180 top
R20  10kΩ  [r0402]  1.37 20.61 180 top
R25  10kΩ  [r0402]  2.66 14.13 270 bottom
R26  10kΩ  [r0402]  6.05 14.11 270 bottom
R27  10kΩ  [r0402]  4.37 14.12 90 bottom
R28  100Ω  [R0402]  4.46 20.58 90 top
R29  0Ω  [R0402]  17.74 22.39 180 top
R30  220kΩ  [R0402]  19.41 5.65 270 bottom
R31  150kΩ  [R0402]  18.93 7.25 0 bottom
R44  33Ω  [R0402]  8.41 14.16 225 top
R48  33Ω  [R0402]  8.5 14.63 270 bottom
R49  33Ω  [R0402]  4.52 17.55 0 bottom
R50  33Ω  [R0402]  7.32 14.64 90 bottom
R57  46.4kΩ  [R0402]  17.68 3.84 0 top
R58  10kΩ  [r0402]  5.29 15.66 180 top
R59  33Ω  [R0402]  12.79 7.88 45 top
R60  33Ω  [R0402]  14.98 8.53 45 top
R61  10kΩ  [r0402]  10.19 9.25 270 top
R62  33Ω  [R0402]  9.19 20.23 0 top
R63  33Ω  [R0402]  8.73 19.08 0 top
R64  2kΩ  [R0402]  21.39 7.9 270 top
R65  2kΩ  [R0402]  24.16 3.43 270 top
R66  8.2kΩ  [R0402]  17.68 2.67 0 top
R67  3kΩ  [R0402]  19.36 6.79 0 top
SIM1  1040310811  [SIM-SMD_8P-1040310811]  6.56 6.94 90 bottom
SW2  SKRPABE010  [KEY-SMD_4P-L4.2-W3.2-P2.20-LS4.6]  6.61 23.25 180 top
U1  ESP32-C3FH4  [QFN-32_L5.0-W5.0-P0.50-TL-EP3.7]  12.6 16.98 270 top
U4  40MHz  [CRYSTAL-SMD_4P-L2.0-W1.6-BL_7D026000M01]  18.82 16.8 270 top
U12  LESD5D5.0CT1G  [SOD-523_L1.2-W0.8-LS1.6-BI]  9.26 5.12 0 top
U13  LESD5D5.0CT1G  [SOD-523_L1.2-W0.8-LS1.6-BI]  10.95 6.04 0 top
U14  LESD5D5.0CT1G  [SOD-523_L1.2-W0.8-LS1.6-BI]  13.54 5.97 180 top
U16  AP2112K-3.3TRG1  [SOT-23-5_L2.9-W1.6-P0.95-LS2.8-BR]  20.99 10.99 180 top
U18  TL1014AF220QG  [SW-SMD_E-SWITCH_TL1014AFXXX]  1.67 16.56 270 top
U19  LSM6DS3TR-C  [LGA-14_L3.0-W2.5-P0.50-TL]  7 9.83 270 top
U22  XL-1005UWC  [LED0402-RD_YELLOW]  24.16 5.63 270 top
U23  BQ24075RGTR  [QFN-16_L3.0-W3.0-P0.50-TL-EP1.7]  21.15 4.31 90 top
USB2  MicroXNJ  [MICRO-USB-SMD_MICROXNJ_1]  12.56 2.74 0 top

## Footprints (pads in the part's own frame, mm; a bottom-side part is the same pattern mirrored in y, then rotated)
ANT-SMD_4P-L3.2-W1.6
  rect 1x0.6 smd: 1(-1.5,-0.65) 2(1.5,-0.65) 3(1.5,0.65) 4(-1.5,0.65)
C0402
  rect 0.5x0.54 smd: 1(-0.42,0) 2(0.42,0)
c0402
  rect 0.566x0.54 smd: 1(-0.433,0) 2(0.433,0)
C0603
  rect 0.8x0.9 smd: 1(-0.7,0) 2(0.7,0)
C0805
  rect 1.41x1.35 smd: 1(-1,0) 2(1,0)
CONN-SMD_1.0T-4P
  rect 0.8x3 smd: 0(-2.8,-1.784) 0(2.8,-1.784)
  rect 0.4x1.6 smd: 1(-1.498,1.784) 2(-0.498,1.784) 3(0.502,1.784) 4(1.502,1.784)
CRYSTAL-SMD_4P-L2.0-W1.6-BL_7D026000M01
  rect 1x0.9 smd: 1(-0.65,-1) 2(-0.65,0.55) 3(1.199,0.55) 4(1.199,-1)
KEY-SMD_4P-L4.2-W3.2-P2.20-LS4.6
  rect 1.05x0.7 smd: 1(-2.1,1.075) 2(2.1,1.075) 3(-2.1,-1.075) 4(2.1,-1.075)
L0603
  rect 0.8x0.864 smd: 1(-0.7,0) 2(0.7,0)
LED0402-RD_GREEN
  rect 0.5x0.54 smd: 1(-0.425,0) 2(0.425,0)
LED0402-RD_YELLOW
  rect 0.636x0.54 smd: 1(-0.538,0) 2(0.538,0)
LED-SMD_4P-L2.0-W2.0-TL_WS2812B-2020
  rect 0.9x0.7 smd: 1(-0.915,0.55) 2(-0.915,-0.55) 3(0.915,-0.55) 4(0.915,0.55)
LGA-14_L3.0-W2.5-P0.50-TL
  rect 0.675x0.28 smd: 1(-1.262,0.75) 2(-1.262,0.25) 3(-1.262,-0.25) 4(-1.262,-0.75) 8(1.262,-0.75) 9(1.262,-0.25) 10(1.262,0.25) 11(1.262,0.75)
  rect 0.28x0.675 smd: 5(-0.5,-1.012) 6(0,-1.012) 7(0.5,-1.012) 12(0.5,1.012) 13(0,1.012) 14(-0.5,1.012)
MICRO-USB-SMD_MICROXNJ_1
  rect 0.4x2 smd: 1(-1.3,1.332) 2(-0.65,1.332) 3(0,1.332) 4(0.65,1.332) 5(1.3,1.332)
  round 1.3 hole 0.7: 6(2.425,1.34) 9(-2.425,1.34)
  oval 1.3x1.8 hole 0.7x1.1: 7(3.625,-1.34) 8(-3.625,-1.34)
Pad_e4
  rect 0.5x0.84 smd: 1(0,0)
Pad_e751
  rect 1x1 smd far side: 1(0,0)
Pad_e1200
  rect 2x1.5 smd far side: 1(0,0)
Pad_e1288
  rect 0.5x0.84 smd: 1(0,0)
Pad_e4021
  rect 2x1.5 smd far side: 1(0,0)
Pad_e4022
  rect 2x1.5 smd far side: 1(0,0)
Pad_e7330
  rect 2x1.5 smd far side: 1(0,0)
Pad_e7559
  rect 2x1.5 smd far side: 1(0,0)
Pad_e7560
  rect 2x1.5 smd far side: 1(0,0)
Pad_e8320
  rect 2x1.5 smd far side: 1(0,0)
Pad_e8322
  rect 2x1.5 smd far side: 1(0,0)
Pad_e8323
  rect 2x1.5 smd far side: 1(0,0)
Pad_e8324
  rect 2x1.5 smd far side: 1(0,0)
Pad_e8926
  rect 2x1.5 smd far side: 1(0,0)
Pad_e8927
  rrect 2x1.5 smd far side: 1(0,0)
QFN-16_L3.0-W3.0-P0.50-TL-EP1.7
  oval 0.85x0.28 smd: 1(-1.5,0.75) 2(-1.5,0.25) 3(-1.5,-0.25) 4(-1.5,-0.75) 9(1.5,-0.75) 10(1.5,-0.25) 11(1.5,0.25) 12(1.5,0.75)
  oval 0.28x0.85 smd: 5(-0.75,-1.5) 6(-0.25,-1.5) 7(0.25,-1.5) 8(0.75,-1.5) 13(0.75,1.5) 14(0.25,1.5) 15(-0.25,1.5) 16(-0.75,1.5)
  custom 1.7x1.7 smd: 17(0,0)
QFN-32_L5.0-W5.0-P0.50-TL-EP3.7
  rect 0.65x0.28 smd: 1(-2.478,1.75) 2(-2.478,1.25) 3(-2.478,0.75) 4(-2.478,0.25) 5(-2.478,-0.25) 6(-2.478,-0.75) 7(-2.478,-1.25) 8(-2.478,-1.75) 17(2.478,-1.75) 18(2.478,-1.25) 19(2.478,-0.75) 20(2.478,-0.25) 21(2.478,0.25) 22(2.478,0.75) 23(2.478,1.25) 24(2.478,1.75)
  rect 0.28x0.65 smd: 9(-1.75,-2.478) 10(-1.25,-2.478) 11(-0.75,-2.478) 12(-0.25,-2.478) 13(0.25,-2.478) 14(0.75,-2.478) 15(1.25,-2.478) 16(1.75,-2.478) 25(1.75,2.478) 26(1.25,2.478) 27(0.75,2.478) 28(0.25,2.478) 29(-0.25,2.478) 30(-0.75,2.478) 31(-1.25,2.478) 32(-1.75,2.478)
  rect 3.8x3.8 smd: 33(0,0)
r0402
  rect 0.566x0.54 smd: 1(-0.433,0) 2(0.433,0)
R0402
  rect 0.566x0.54 smd: 1(-0.433,0) 2(0.433,0)
R0603
  rect 0.806x0.864 smd: 1(-0.753,0) 2(0.753,0)
SIM-SMD_8P-1040310811
  rect 0.7x1.2 smd: 1(3.138,-5.338) 2(2.038,-5.338) 3(0.938,-5.338) 4(-0.163,-5.338) 5(-1.262,-5.338) 6(-2.362,-5.338) 7(-3.462,-5.338) 8(-4.562,-5.338)
  rect 1.17x1.8 smd: 9(-5.772,-5.138)
  rect 1.55x1.35 smd: 10(5.598,-5.312)
  rect 1.2x1 smd: 11(5.772,0.662) 12(5.772,4.362)
  rect 1.9x1.35 smd: 13(2.272,5.338) 14(-3.697,5.338)
SOD-123_L2.7-W1.6-LS3.7-RD
  rect 0.91x1.22 smd: 1(-1.635,0) 2(1.635,0)
SOD-523_L1.2-W0.8-LS1.6-BI
  rect 0.6x0.4 smd: 1(-0.75,0) 2(0.75,0)
SOT-23-5_L2.9-W1.6-P0.95-LS2.8-BR
  rect 1x0.6 smd: 1(1.1,-0.95) 2(1.1,0) 3(1.1,0.95) 4(-1.1,0.95) 5(-1.1,-0.95)
SW-SMD_E-SWITCH_TL1014AFXXX
  rect 1.2x1 smd: 1(2.8,0.85) 2(2.8,-0.85) 3(-2.8,0.85) 4(-2.8,-0.85)

## Nets
+3V3: C3.1 C4.2 C5.2 C6.2 C8.2 C9.2 C12.1 C21.2 C24.1 C25.1 C26.1 CN1.2 L4.1 LED3.4 NOREF#9.1 R11.2 R19.2 R20.1 R25.1 R26.1 R27.2 R58.2 R61.2 SIM1.4 U1.11 U1.17 U1.31 U1.32 U16.5 U19.5 U19.8 U19.12
GND: ANT2.2 ANT2.3 ANT2.4 C3.2 C4.1 C5.1 C6.1 C7.1 C8.1 C9.1 C10.2 C11.1 C12.2 C14.1 C16.1 C18.1 C21.1 C24.2 C25.2 C26.2 C27.1 C28.2 C29.1 C31.1 C33.1 C34.1 CN1.0 CN1.1 LED3.2 NOREF#10.1 NOREF#12.1 R17.1 R31.1 R57.1 R66.1 R67.1 SIM1.1 SIM1.6 SIM1.8 SW2.4 U1.33 U4.2 U4.4 U12.1 U13.1 U14.1 U16.2 U18.1 U19.1 U19.2 U19.3 U19.6 U19.7 U23.4 U23.6 U23.8 U23.15 U23.17 USB2.5 USB2.6 USB2.7 USB2.8 USB2.9
VBUS: C16.2 C18.2 C28.1 D1.1 U23.13
BAT+: C33.2 NOREF#8.1 NOREF#13.1 R30.2 U23.2 U23.3
BATTERY_V_LEVEL: NOREF#7.1 R30.1 R31.2
BOOT/PB: R20.2 U1.15 U18.4
CHIP_EN: C14.2 R11.1 SW2.2 U1.7
D+: R60.2 U1.26
D-: R59.2 U1.25
GPIO0: NOREF#15.1 U1.4
GPIO1: NOREF#4.1 U1.5
IMU_INT: U1.8 U19.4
POW: C27.2 C29.2 NOREF#3.1 R64.2 R65.2 U16.1 U16.3 U23.5 U23.10 U23.11
RGB: R28.1 R58.1 U1.14
RX: NOREF#6.1 U1.27
SCL: CN1.4 R61.1 R63.1 U19.13
SD_CS: NOREF.1 R44.1 U1.16
SDA: CN1.3 R19.1 R62.1 U19.14
SPCLK: NOREF#5.1 R49.2 U1.12
SPID/MOSI: NOREF#11.1 R50.2 U1.13
SPIQ/MISO: NOREF#14.1 R48.1 U1.6
TX: NOREF#2.1 U1.28
XTAL_N: C10.1 U1.29 U4.3
XTAL_P: C11.2 U1.30 U4.1
$1N1048: L4.2 U1.2 U1.3
$1N1429: C7.2 U1.18
$1N2460: C31.2 R29.2 U1.1
$1N25832: D1.2 U12.2 USB2.1
$1N25847: R59.1 U13.2 USB2.2
$1N25849: R60.1 U14.2 USB2.3
$1N31251: ANT2.1 C34.2 R29.1
$1N47755: LED3.3 R28.2
$1N85064: R26.2 R50.1 SIM1.7
$1N94189: U22.1 U23.7
$1N94195: LED5.1 U23.9
$1N94200: R17.2 U23.1
$1N94207: R57.2 U23.14
$1N94553: R27.1 R48.2 SIM1.3
$1N94607: R49.1 SIM1.5
$1N94651: R25.2 R44.2 SIM1.2
$1N97194: R62.2 U1.9
$1N97235: R63.2 U1.10
$1N106267: LED5.2 R64.1
$1N106270: R65.1 U22.2
$1N126315: R66.2 U23.16
$1N126394: R67.2 U23.12

Pads without a net: LED3 1; SIM1 9 10 11 12 13 14; SW2 1 3; U1 19 20 21 22 23 24; U16 4; U18 2 3; U19 9 10 11; USB2 4

## Via types
v1: diameter 0.6, hole 0.3, Top Layer to Bottom Layer, 179 vias
v2: diameter 0.8, hole 0.4, Top Layer to Bottom Layer, 9 vias

## Routing (per net, layer and track width the routed paths; a pad name or vN(x,y) marks a point on that pad's centre or on a via; arc(x,y) is an arc through that point)
+3V3: length 35.5
  Top Layer w0.27: v2(8.81,17.95) 9.03,17.73 10.12,17.73 U1.11 ; U19.12 8.41,9.33 8.66,9.08 ; U19.5 5.66,10.33 5.33,10.65 v1(4.96,10.65) ; U1.17 10.85,14.09 10.69,13.93 ; 16.45,18.66 16.38,18.73 v1(15.88,18.73) U1.32 U1.31
  Top Layer w0.28: v1(4.96,10.65) 4.98,10.64 4.98,10.26 ; U19.8 6.25,7.6
  Top Layer w0.3: v2(10.18,14.26) 10.51,13.93 10.69,13.93 10.69,13.39
  Top Layer w0.35: C5.2 8.72,17.86 v2(8.81,17.95) ; CN1.2 4.14,6.7 v1(5.08,7.64) 4.49,7.64 3.93,8.2 ; R19.2 9.09,11.1 v1(9.09,11.68) ; v2(2.53,20.61) R20.1 ; R58.2 4.58,15.66 4.27,15.97 v2(4.16,15.97) ; v1(9.47,8.92) 10,8.92
  Top Layer w0.4: 8.66,9.08 8.66,9.08 9.31,9.08 v1(9.47,8.92)
  Top Layer w0.5: 12.88,24.24 12.88,24.23 ; 12.88,24.24 12.87,24.24 ; 12.88,24.24 11.71,24.24 11.7,24.23 11.7,23.27 ; C25.1 6.13,7.64 v1(5.08,7.64) ; v1(10.24,23.47) 9.91,23.14 R11.2 ; U16.5 23.31,11.94 ; 16.45,18.66 16.49,18.7 v1(16.49,19.25) 16.49,19.8 16.46,19.83 ; 23.49,11.76 23.52,11.73 ; C12.1 3.18,23.02 LED3.4 ; v2(23.51,12.61) 23.52,12.61 C21.2
  Bottom Layer w0.4: v1(5.08,7.64) 4.22,6.78 SIM1.4 ; v1(2.1,15.15) 2.1,15.13 2.66,14.56 4.36,14.56 R27.2 6.04,14.55 R26.1
  Bottom Layer w0.5: NOREF#9.1 2.05,19.39 2.53,19.87 v2(2.53,20.61)
  vias: v1(3.23,23.61) v1(12.29,24.24)
GND: length 2.7
  Top Layer w0.27: v1(20.77,4.01) 20.72,4.06 U23.15 ; v1(21.52,4.01) 21.52,3.75 21.9,3.37 U23.4
  Top Layer w0.5: 5.98,9.5 5.98,9.7
  vias: v1(0.47,17.04) v1(1.63,24.05) v1(1.86,11.28) v1(1.86,10.65) v1(2.14,4.71) v1(2.72,4.36) v1(3.32,16.56) v1(3.48,12.55) v1(3.48,2.55) v1(3.48,1.55) v1(3.66,19.09) v1(4.48,3.55) v1(4.48,2.55) v1(4.48,1.55) v1(4.98,8.54) v1(5.48,2.55) v1(5.48,1.55) v1(6.51,18.16) v1(6.48,3.55) v1(6.48,2.55) v1(6.48,1.55) v1(7.48,5.55) v1(7.48,4.55) v1(7.66,7.54) v1(8.46,7.7) v1(8.48,4.55) v1(8.48,3.55) v1(8.48,2.55) v1(9.19,7.96) v1(9.48,2.55) v1(9.87,13.37) v1(10.1,24.4) v1(10.48,6.55) v1(10.48,2.55) v1(10.48,1.55) v1(11.16,7.17) v1(11.38,18.17) v1(11.38,16.97) v1(11.38,15.74) v1(11.48,11.55) v1(11.48,1.55) v1(12.58,22.16) v1(12.58,18.17) v1(12.58,16.97) v1(12.58,15.76) v1(13.13,11.59) v1(13.36,9.7) v1(13.48,12.55) v1(13.48,10.55) v1(13.51,0.94) v1(13.78,18.17) v1(13.78,16.97) v1(13.78,15.76) v1(13.97,22.68) v1(13.97,21.93) v1(13.98,21.18) v1(13.98,20.44) v1(14.38,23.39) v1(14.49,24.19) v1(14.65,0.95) v1(15.01,5) v1(15.05,23.48) v1(15.24,24.19) v1(15.51,21.6) v1(15.52,20.88) v1(15.55,20.18) v1(15.58,19.54) v1(15.8,23.48) v1(15.99,24.19) v1(16.23,20.76) v1(16.36,9.1) v1(16.38,7.46) v1(16.55,23.48) v1(16.74,24.19) v1(16.98,21.46) v1(16.98,20.76) v1(17.3,23.48) v1(17.49,24.19) v1(17.66,7) v1(17.73,21.46) v1(17.72,20.74) v1(18.05,23.48) v1(18.24,24.19) v1(18.22,19.7) v1(18.48,21.46) v1(18.48,20.75) v1(18.8,23.48) v1(18.99,24.19) v1(18.97,19.7) v1(19.23,20.75) v1(19.4,2.55) v1(19.55,23.48) v1(19.71,24.48) v1(19.97,21.23) v1(19.97,20.48) v1(19.97,19.73) v1(19.97,18.98) v1(19.97,18.23) v1(20.25,17.51) v1(20.43,24.52) v1(20.77,4.76) v1(21,17.51) v1(21.01,11.24) v1(20.99,10.47) v1(20.99,9.8) v1(21.04,14.31) v1(21.03,13.55) v1(21.02,12.78) v1(21.02,11.98) v1(21.18,24.52) v1(21.12,9.14) v1(21.22,16.7) v1(21.48,15.55) v1(21.55,14.76) v1(21.52,4.76) v1(21.75,17.51) v1(21.73,13.71) v1(21.93,24.52) v1(21.98,13.02) v1(21.99,9.13) v1(22.5,17.51) v1(22.48,13.55) v1(22.68,24.52) v1(22.85,9.14) v1(23.25,17.53) v1(23.43,24.52) v1(23.48,9.55) v1(24,17.53) v1(24.08,9.1) v1(24.18,24.52) v1(24.12,13.55) v1(24.16,0.88) v1(24.6,23.88) v1(24.6,23.12) v1(24.6,22.38) v1(24.6,21.62) v1(24.6,20.87) v1(24.6,20.12) v1(24.6,19.38) v1(24.6,18.62) v1(24.6,17.88)
VBUS: length 7.1
  Top Layer w0.27: 18.02,5 18.08,5.06 U23.13
  Top Layer w0.5: 18.02,5 17.98,5.04 v2(17.98,5.77)
  Bottom Layer w0.4: 16.37,4.7 17.71,4.7 17.96,4.45
  Bottom Layer w0.5: v2(17.98,5.77) 17.98,4.48 17.96,4.45 ; 16.23,6.3 16.37,6.16 16.37,4.7
BAT+: length 9.7
  Top Layer w0.27: U23.2 U23.3 21.4,1.35 21.42,1.33
  Top Layer w0.5: C33.2 21.5,1.17 v2(20.77,1.17)
  Bottom Layer w0.3: v2(20.77,1.17) 20.66,1.17 20,1.83 20,3.1 19.52,3.58 19.52,5.11 R30.2
  Bottom Layer w0.5: 20.77,1.18 20.88,1.29 22.11,1.29 22.61,1.79 NOREF#13.1
BATTERY_V_LEVEL: length 6.5
  Bottom Layer w0.3: 14.87,8.5 15.12,8.25 18.89,8.25 19.36,7.78 R31.2 19.41,7.2 19.41,6.08
BOOT/PB: length 13.9
  Top Layer w0.27: 8.11,15.34 8.5,15.73 U1.15
  Top Layer w0.35: U18.4 0.94,19.48 R20.2
  Top Layer w0.4: 8.11,15.34 7.36,14.59 4.18,14.59 0.82,17.95 U18.4
CHIP_EN: length 9.5
  Top Layer w0.27: 10,21.84 10,21.45 11.35,20.1 11.35,19.52
  Top Layer w0.4: 4.81,22.18 6.38,22.18 7.25,21.31 9.54,21.31 9.91,21.68 ; 10,21.84 11.06,21.84
D+: length 7.9
  Top Layer w0.27: 15.93,15.5 15.71,15.73 U1.26
  Top Layer w0.356: R60.2 15.28,8.98 15.93,9.62 15.93,15.5
D-: length 8
  Top Layer w0.27: 15.2,15.18 15.2,14.67
  Top Layer w0.35: 13,8.17 13.22,8.17 15.2,10.15 15.2,14.62
GPIO0: length 11.6
  Top Layer w0.27: v1(12.73,21.44) 12.85,21.33 U1.4
  Bottom Layer w0.35: v1(12.73,21.44) 13.17,21 13.17,19.99 16.01,17.15 16.01,14.5 NOREF#15.1
GPIO1: length 14.2
  Top Layer w0.27: v1(12.11,21.02) 12.35,20.79 U1.5
  Inner1 w0.35: v1(12.11,21.02) 14.94,18.2 14.94,12.46 v1(14.16,11.68)
  Bottom Layer w0.35: 15.19,10.42 15.19,10.65 v1(14.16,11.68)
IMU_INT: length 19
  Top Layer w0.2: U1.8 10.85,19.63 v1(10.45,20.03)
  Top Layer w0.27: v1(5.3,12.12) 5.61,12.12 6.25,11.48 U19.4
  Inner2 w0.35: v1(5.3,12.12) 5.3,16.41 4.35,17.36 4.35,20.6 5.4,21.65 9.73,21.65 10.45,20.93 v1(10.45,20.03)
POW: length 19.6
  Top Layer w0.27: U23.10 v2(21.4,6.73) ; U23.5 23.18,3.56 23.78,2.96 24.17,2.96
  Top Layer w0.35: v2(24.42,2.23) 24.17,2.49 24.17,2.96
  Top Layer w0.4: 21.38,7.48 20.83,7.48 19.87,8.44
  Top Layer w0.5: U16.3 19.89,8.46 19.87,8.44 ; U16.3 19.89,10.04 19.2,10.04 18.75,10.49 18.75,11.56 19.13,11.94 U16.1 ; U16.3 17.67,10.04 C27.2 ; v2(21.4,6.73) 21.4,7.46 R64.2
  Inner1 w0.4: v2(21.4,6.73) 22.84,5.28 22.84,3.82 v2(24.42,2.23)
RGB: length 9.7
  Top Layer w0.27: U1.14 7.71,16.23 7.32,15.84
  Top Layer w0.35: 7.32,15.84 7.15,15.66 R58.1 5.72,16.35 4.45,17.62 4.45,20.14 R28.1
RX: length 5.1
  Top Layer w0.27: U1.27 16.01,16.23 16.46,15.78 16.46,14.05 v1(16.92,13.59)
  Bottom Layer w0.35: v1(16.92,13.59) 17.7,12.81
SCL: length 25.3
  Top Layer w0.27: 10.19,9.86 10.15,9.83 U19.13
  Top Layer w0.35: v1(10.67,10.17) 10.5,10.17 10.19,9.86 ; v1(7.67,19.08) 8.29,19.08 R63.1 ; R61.1 10.19,9.69 10.78,9.69 11.03,9.44 11.03,8.28 9.28,6.53 6.38,6.53 6.13,6.28 6.13,5.43 CN1.4
  Inner2 w0.35: v1(10.67,10.17) 11.59,10.17 12.36,10.94 12.36,13.59 10.19,15.76 10.19,18.35 9.45,19.08 v1(7.67,19.08)
SD_CS: length 10.6
  Top Layer w0.27: U1.16 9.54,15.23 v1(9.27,14.96) 8.78,14.47 R44.1
  Inner1 w0.35: v1(6.23,19.47) 7.98,17.72 7.98,16.25 v1(9.27,14.96)
  Bottom Layer w0.35: 8.44,21.62 8.38,21.62 v1(6.23,19.47)
SDA: length 25.4
  Top Layer w0.27: U19.14 9.57,10.33 10,10.75 10,11.06
  Top Layer w0.35: v1(8.14,20.25) 8.16,20.23 R62.1 ; CN1.3 5.14,4.4 v1(5.49,4.05) ; v1(9.98,11.66) 10,11.64 10,11.06
  Inner1 w0.35: v1(9.98,11.66) 9.98,11.35 5.49,6.86 v1(5.49,4.05)
  Inner2 w0.35: v1(9.98,11.66) 9.98,12.16 7.56,14.58 7.56,17.99 6.97,18.58 6.97,19.72 7.5,20.25 v1(8.14,20.25)
SPCLK: length 10.2
  Top Layer w0.27: v1(5.98,17.56) 6.31,17.23 U1.12
  Inner2 w0.35: v1(5.98,17.56) 5.8,17.56 5.27,18.09 5.27,20.1 5.73,20.56 v1(5.96,20.56)
  Bottom Layer w0.35: v1(5.98,17.56) 4.96,17.56 R49.2 ; NOREF#5.1 5.98,20.58 v1(5.96,20.56)
SPID/MOSI: length 15
  Top Layer w0.27: U1.13 8.23,16.73
  Top Layer w0.3: v1(6.62,16.62) 6.73,16.73 8.23,16.73
  Inner1 w0.35: v1(4.67,23.35) 4.66,23.34 4.66,17.6 5.64,16.62 v1(6.62,16.62)
  Bottom Layer w0.35: R50.2 7.32,15.92 v1(6.62,16.62) ; NOREF#11.1 5.56,23.35 v1(4.67,23.35)
SPIQ/MISO: length 13.2
  Top Layer w0.27: v1(11.34,21.03) 11.34,20.8 11.85,20.3 U1.6
  Bottom Layer w0.35: 8.5,15.06 8.5,15.81 9.89,17.2 9.89,18.29 11.34,19.74 v1(11.34,21.03) 11.34,21.36 8.93,23.77 8.44,23.77
TX: length 12.3
  Top Layer w0.27: U1.28 16.19,16.73 16.93,15.99 16.93,14.75 17.26,14.42 v1(17.43,14.42)
  Bottom Layer w0.35: NOREF#2.1 17.95,9.82 19.07,9.82 19.97,10.72 19.97,13.78 19.31,14.44 17.45,14.44 v1(17.43,14.42)
XTAL_N: length 6.1
  Top Layer w0.27: 15.75,17.23 U1.29
  Top Layer w0.3: U4.3 18.48,16.49 17.24,16.49 16.5,17.23 15.75,17.23
  Top Layer w0.5: 19.39,15.58 C10.1
XTAL_P: length 4.3
  Top Layer w0.27: 15.74,17.73 U1.30
  Top Layer w0.3: 15.74,17.73 17.54,17.73 U4.1 17.82,17.53 18.53,18.24 C11.2
$1N1048: length 4
  Top Layer w0.27: 13.09,23.05 13.35,22.79 U1.3
  Top Layer w0.4: 13.74,19.45 13.44,19.45
$1N1429: length 1.4
  Top Layer w0.27: U1.18 11.35,14.1 12.06,13.39 12.06,13.35
$1N2460: length 5.4
  Top Layer w0.4: 17.12,22.41 15.81,22.41 arc(15.82,22.39) 15.83,22.37 ; 15.81,22.4 arc(15.79,22.41) 15.77,22.41 15.22,22.41 arc(14.88,22.27) 14.74,21.93 14.74,19.72 arc(14.66,19.52) 14.46,19.43
$1N25832: length 11.5
  Top Layer w0.4: v1(14.67,2.36) 11.81,2.36 11.26,2.91 11.26,4.83 10.97,5.12 U12.2
  Bottom Layer w0.4: v1(14.67,2.36) 14.69,2.38 15.35,2.38 15.71,2.74 17.23,2.74 17.89,2.08 17.89,1.19
$1N25847: length 3.3
  Top Layer w0.35: 11.88,4.5 11.91,4.53 11.91,6.87 12.48,7.44 R59.1
$1N25849: length 4.7
  Top Layer w0.356: 14.63,8.32 12.56,6.25 12.56,4.5
$1N31251: length 2.3
  Top Layer w0.4: 20.53,22.4 18.2,22.4
$1N47755: length 1.7
  Top Layer w0.4: R28.2 4.28,21.01 3.46,21.83 LED3.3
$1N85064: length 14.9
  Bottom Layer w0.35: 1.18,3.56 1.2,3.54 3.25,3.54 6.02,6.31 6.02,13.65 6.05,13.68 6.63,13.68 7.06,14.11 7.2,14.11 7.32,14.23
$1N94189: length 2.9
  Top Layer w0.27: U22.1 24.14,6.19 23.61,6.19 23.44,6.02 23.44,4.85 23.15,4.56 U23.7
$1N94195: length 1.7
  Top Layer w0.27: 22.59,7.21 22.59,6.88 21.9,6.19 21.9,5.81 U23.9
$1N94200: length 1.8
  Top Layer w0.27: U23.1 20.4,2.22 19.51,1.34
$1N94207: length 1.8
  Top Layer w0.27: U23.14 18.9,4.56 18.18,3.84 R57.2
$1N94553: length 14.8
  Inner1 w0.35: v1(4.06,11.28) 7.47,11.28 v1(8.28,12.09)
  Bottom Layer w0.35: R27.1 4.37,11.59 v1(4.06,11.28) 4.06,9.2 2.82,7.96 1.19,7.96 ; R48.2 8.5,12.31 v1(8.28,12.09)
$1N94607: length 15.4
  Inner1 w0.35: v1(2.23,5.7) 1.08,6.85 1.08,16.07 2.57,17.56 v1(3.46,17.56)
  Bottom Layer w0.35: v1(3.46,17.56) 4.08,17.56 R49.1
  Bottom Layer w0.4: 2.17,5.69 2.16,5.68 SIM1.5
$1N94651: length 11.4
  Top Layer w0.35: v1(3.55,13.65) 7.96,13.65 8.1,13.78 R44.2
  Bottom Layer w0.35: 1.19,9.06 2.13,9.06 2.16,9.09 2.16,9.11 2.53,9.48 2.54,9.48 2.64,9.57 v1(2.64,11.99) 2.64,13.68 R25.2 2.71,13.65 v1(3.55,13.65)
$1N97194: length 1.8
  Top Layer w0.27: U1.9 10.03,18.73 10.01,18.75 10.01,19.41 9.62,19.8 R62.2
$1N97235: length 1.5
  Top Layer w0.27: 9.16,19.08 9.16,18.69 9.62,18.23 U1.10
$1N106267: length 1.2
  Top Layer w0.4: 21.43,8.3 22.57,8.3 22.59,8.29
$1N106270: length 1.3
  Top Layer w0.4: U22.2 24.16,3.85 24.19,3.82
$1N126315: length 1.9
  Top Layer w0.27: 18.11,2.68 18.36,2.68 19.24,3.56 U23.16
$1N126394: length 1.3
  Top Layer w0.27: U23.12 20.4,6.13 19.77,6.76 19.77,6.82

## Copper pours and planes (outline as drawn; the poured copper is in the pictures)
+3V3 on Inner2: -7.53,31.73 37.65,31.73 37.65,-10.93 -7.53,-10.93
GND on Top Layer: -7.35,-11.57 -7.35,32.16 33.82,32.16 33.82,-11.57
GND on Bottom Layer: -7.04,32.29 37.52,32.29 37.52,-10.3 -7.04,-10.3
GND on Inner1: -7.05,32.51 36.55,32.51 36.55,-9.77 -7.05,-9.77

Small or netless copper shapes (teardrops, artwork), in the pictures only: 6 on Top Layer, 4 on Bottom Layer

## Text on the board
Bottom Silkscreen Layer: 3V3 | GND | bat-lvl | BAT | TX| | RX| | 21 | 20 | 0 | 1 | SPI | 7 | 6 | 10 | 2 | + | - | Rev5
Top Silkscreen Layer: SDA | SCL | GND | 3V3 | RST | BOOT
